# EasyEDA Pro project ProProject_SmartNixieClock_2023-12-15.epro, schematic Main_1
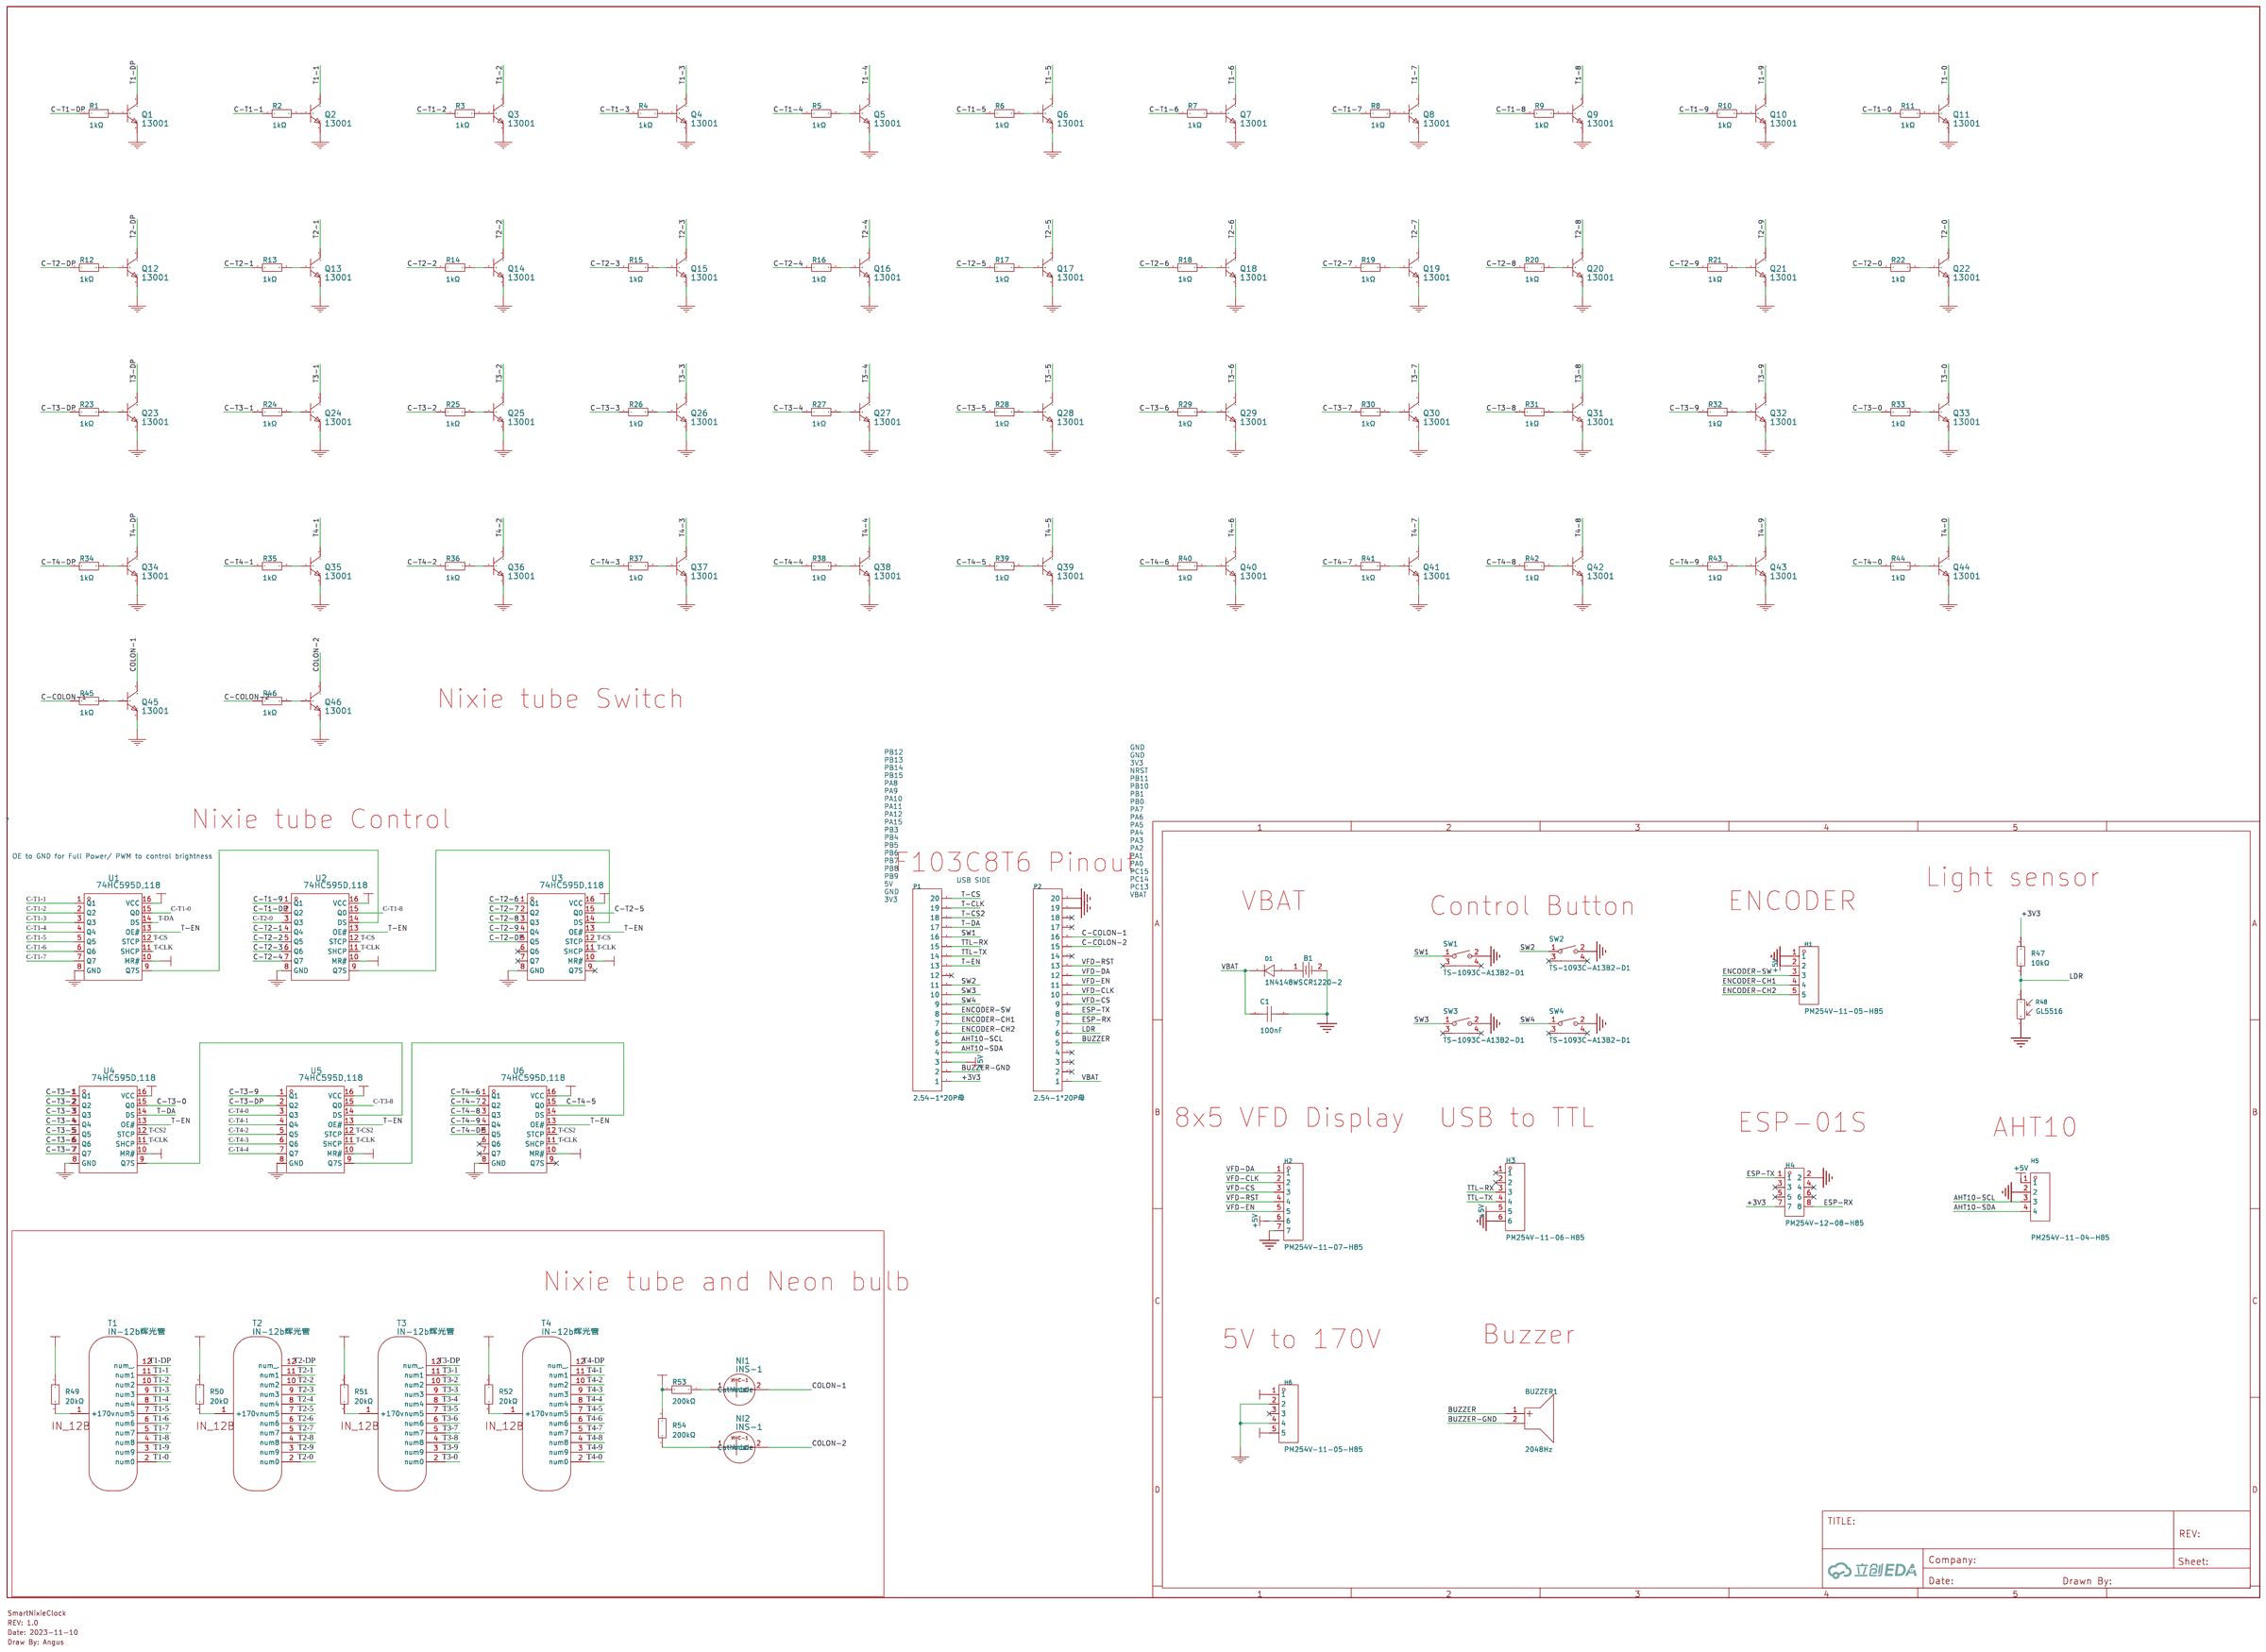
[diagram p1: schematic sheet]

## Parts
B1  CR1220-2  [BAT-SMD_CR1220-2]
BUZZER1  2048Hz  [BUZ-TH_BD12.0-P6.50-D0.6-FD]  (no BOM)
C1  100nF  [C0603]
D1  1N4148WS  [SOD-323_L1.8-W1.3-LS2.5-RD]
H1  PM254V-11-05-H85  [HDR-TH_5P-P2.54-V-F]
H2  PM254V-11-07-H85  [HDR-TH_7P-P2.54-V-F]
H3  PM254V-11-06-H85  [HDR-TH_6P-P2.54-V-F]
H4  PM254V-12-08-H85  [HDR-TH_8P-P2.54-V-F-R2-C4-S2.54]
H5  PM254V-11-04-H85  [HDR-TH_4P-P2.54-V-F]
H6  PM254V-11-05-H85  [HDR-TH_5P-P2.54-V-F]
NI1  INS-1  [INS-1]  (no BOM)
NI2  INS-1  [INS-1]  (no BOM)
P1  2.54-1*20P母  [HDR-TH_20P-P2.54-V-F]
P2  2.54-1*20P母  [HDR-TH_20P-P2.54-V-F]
Q1  13001  [SOT-23-3_L2.9-W1.3-P1.90-LS2.4-BR]
Q2  13001  [SOT-23-3_L2.9-W1.3-P1.90-LS2.4-BR]
Q3  13001  [SOT-23-3_L2.9-W1.3-P1.90-LS2.4-BR]
Q4  13001  [SOT-23-3_L2.9-W1.3-P1.90-LS2.4-BR]
Q5  13001  [SOT-23-3_L2.9-W1.3-P1.90-LS2.4-BR]
Q6  13001  [SOT-23-3_L2.9-W1.3-P1.90-LS2.4-BR]
Q7  13001  [SOT-23-3_L2.9-W1.3-P1.90-LS2.4-BR]
Q8  13001  [SOT-23-3_L2.9-W1.3-P1.90-LS2.4-BR]
Q9  13001  [SOT-23-3_L2.9-W1.3-P1.90-LS2.4-BR]
Q10  13001  [SOT-23-3_L2.9-W1.3-P1.90-LS2.4-BR]
Q11  13001  [SOT-23-3_L2.9-W1.3-P1.90-LS2.4-BR]
Q12  13001  [SOT-23-3_L2.9-W1.3-P1.90-LS2.4-BR]
Q13  13001  [SOT-23-3_L2.9-W1.3-P1.90-LS2.4-BR]
Q14  13001  [SOT-23-3_L2.9-W1.3-P1.90-LS2.4-BR]
Q15  13001  [SOT-23-3_L2.9-W1.3-P1.90-LS2.4-BR]
Q16  13001  [SOT-23-3_L2.9-W1.3-P1.90-LS2.4-BR]
Q17  13001  [SOT-23-3_L2.9-W1.3-P1.90-LS2.4-BR]
Q18  13001  [SOT-23-3_L2.9-W1.3-P1.90-LS2.4-BR]
Q19  13001  [SOT-23-3_L2.9-W1.3-P1.90-LS2.4-BR]
Q20  13001  [SOT-23-3_L2.9-W1.3-P1.90-LS2.4-BR]
Q21  13001  [SOT-23-3_L2.9-W1.3-P1.90-LS2.4-BR]
Q22  13001  [SOT-23-3_L2.9-W1.3-P1.90-LS2.4-BR]
Q23  13001  [SOT-23-3_L2.9-W1.3-P1.90-LS2.4-BR]
Q24  13001  [SOT-23-3_L2.9-W1.3-P1.90-LS2.4-BR]
Q25  13001  [SOT-23-3_L2.9-W1.3-P1.90-LS2.4-BR]
Q26  13001  [SOT-23-3_L2.9-W1.3-P1.90-LS2.4-BR]
Q27  13001  [SOT-23-3_L2.9-W1.3-P1.90-LS2.4-BR]
Q28  13001  [SOT-23-3_L2.9-W1.3-P1.90-LS2.4-BR]
Q29  13001  [SOT-23-3_L2.9-W1.3-P1.90-LS2.4-BR]
Q30  13001  [SOT-23-3_L2.9-W1.3-P1.90-LS2.4-BR]
Q31  13001  [SOT-23-3_L2.9-W1.3-P1.90-LS2.4-BR]
Q32  13001  [SOT-23-3_L2.9-W1.3-P1.90-LS2.4-BR]
Q33  13001  [SOT-23-3_L2.9-W1.3-P1.90-LS2.4-BR]
Q34  13001  [SOT-23-3_L2.9-W1.3-P1.90-LS2.4-BR]
Q35  13001  [SOT-23-3_L2.9-W1.3-P1.90-LS2.4-BR]
Q36  13001  [SOT-23-3_L2.9-W1.3-P1.90-LS2.4-BR]
Q37  13001  [SOT-23-3_L2.9-W1.3-P1.90-LS2.4-BR]
Q38  13001  [SOT-23-3_L2.9-W1.3-P1.90-LS2.4-BR]
Q39  13001  [SOT-23-3_L2.9-W1.3-P1.90-LS2.4-BR]
Q40  13001  [SOT-23-3_L2.9-W1.3-P1.90-LS2.4-BR]
Q41  13001  [SOT-23-3_L2.9-W1.3-P1.90-LS2.4-BR]
Q42  13001  [SOT-23-3_L2.9-W1.3-P1.90-LS2.4-BR]
Q43  13001  [SOT-23-3_L2.9-W1.3-P1.90-LS2.4-BR]
Q44  13001  [SOT-23-3_L2.9-W1.3-P1.90-LS2.4-BR]
Q45  13001  [SOT-23-3_L2.9-W1.3-P1.90-LS2.4-BR]
Q46  13001  [SOT-23-3_L2.9-W1.3-P1.90-LS2.4-BR]
R1  1kΩ  [R0805]
R2  1kΩ  [R0805]
R3  1kΩ  [R0805]
R4  1kΩ  [R0805]
R5  1kΩ  [R0805]
R6  1kΩ  [R0805]
R7  1kΩ  [R0805]
R8  1kΩ  [R0805]
R9  1kΩ  [R0805]
R10  1kΩ  [R0805]
R11  1kΩ  [R0805]
R12  1kΩ  [R0805]
R13  1kΩ  [R0805]
R14  1kΩ  [R0805]
R15  1kΩ  [R0805]
R16  1kΩ  [R0805]
R17  1kΩ  [R0805]
R18  1kΩ  [R0805]
R19  1kΩ  [R0805]
R20  1kΩ  [R0805]
R21  1kΩ  [R0805]
R22  1kΩ  [R0805]
R23  1kΩ  [R0805]
R24  1kΩ  [R0805]
R25  1kΩ  [R0805]
R26  1kΩ  [R0805]
R27  1kΩ  [R0805]
R28  1kΩ  [R0805]
R29  1kΩ  [R0805]
R30  1kΩ  [R0805]
R31  1kΩ  [R0805]
R32  1kΩ  [R0805]
R33  1kΩ  [R0805]
R34  1kΩ  [R0805]
R35  1kΩ  [R0805]
R36  1kΩ  [R0805]
R37  1kΩ  [R0805]
R38  1kΩ  [R0805]
R39  1kΩ  [R0805]
R40  1kΩ  [R0805]
R41  1kΩ  [R0805]
R42  1kΩ  [R0805]
R43  1kΩ  [R0805]
R44  1kΩ  [R0805]
R45  1kΩ  [R0805]
R46  1kΩ  [R0805]
R47  10kΩ  [R0805]
R48  GL5516  [RES-TH_L5.1-W4.3-P3.40-D0.5]  (no BOM)
R49  20kΩ  [R0805]
R50  20kΩ  [R0805]
R51  20kΩ  [R0805]
R52  20kΩ  [R0805]
R53  200kΩ  [R0805]
R54  200kΩ  [R0805]
SW1  TS-1093C-A13B2-D1  [SW-TH_TS-1093C-A13B3-D1]  (no BOM)
SW2  TS-1093C-A13B2-D1  [SW-TH_TS-1093C-A13B3-D1]  (no BOM)
SW3  TS-1093C-A13B2-D1  [SW-TH_TS-1093C-A13B3-D1]  (no BOM)
SW4  TS-1093C-A13B2-D1  [SW-TH_TS-1093C-A13B3-D1]  (no BOM)
T1  IN-12b辉光管  [IN-12b(正常,插針在上面)]  (no BOM)
T2  IN-12b辉光管  [IN-12b(正常,插針在上面)]  (no BOM)
T3  IN-12b辉光管  [IN-12b(正常,插針在上面)]  (no BOM)
T4  IN-12b辉光管  [IN-12b(正常,插針在上面)]  (no BOM)
U1  74HC595D,118  [SOIC-16_L9.9-W3.9-P1.27-LS6.0-BL]
U2  74HC595D,118  [SOIC-16_L9.9-W3.9-P1.27-LS6.0-BL]
U3  74HC595D,118  [SOIC-16_L9.9-W3.9-P1.27-LS6.0-BL]
U4  74HC595D,118  [SOIC-16_L9.9-W3.9-P1.27-LS6.0-BL]
U5  74HC595D,118  [SOIC-16_L9.9-W3.9-P1.27-LS6.0-BL]
U6  74HC595D,118  [SOIC-16_L9.9-W3.9-P1.27-LS6.0-BL]

## Library data of the parts
B1 = CR1220-2: 连接器类型:电池底座;适用电池规格:CR1220;工作温度范围:-;; LCSC Part Name: 电池底座 适用电池:CR1220; Supplier Part: C70381; Manufacturer: Q&amp;J; Supplier Footprint: SMD; JLCPCB Part Class: Extended Part; Datasheet: https://atta.szlcsc.com/upload/public/pdf/source/20160427/1461725216696.pdf; Supplier: LCSC; Connector Type: 电池底座; Battery Type: CR1220
BUZZER1 = YS-MBZ12085C05R42: 驱动方式:无源(外部驱动);构造类型:电磁式;额定电压:5V;工作电压:3V~7V;频率:2048Hz;声压(SPL):85dB@5V,10cm;直径(φD):12mm;高度:8.7mm;; LCSC Part Name: 电磁式无源分体蜂鸣器5V; Supplier Part: C409842; Manufacturer: Fengming(锋鸣电子); Supplier Footprint: 插件,D=12mm; JLCPCB Part Class: 扩展库; Datasheet: https://atta.szlcsc.com/upload/public/pdf/source/20191217/C409842_D981B29AAA35E8D23D61A24851812BB0.pdf; Supplier: LCSC; Oscillator Circuit: 无源(外部驱动); Technology Type: 电磁式; Rated Voltage: 5V; Operating Voltage: 3V~7V; Sound Pressure Level (SPL): 85dB@5V,10cm; Diameter (φD): 12mm; Height: 8.7mm
C1 = CC0603KRX7R9BB104: 容值:100nF;精度:±10%;额定电压:50V;材质(温度系数):X7R;; LCSC Part Name: 100nF ±10% 50V; Supplier Part: C14663; Manufacturer: YAGEO(国巨); Supplier Footprint: 0603; JLCPCB Part Class: 基础库; Datasheet: https://atta.szlcsc.com/upload/public/pdf/source/20180910/C282072_33301C7F631E79921B82A8DAC6BCC5B3.pdf; Supplier: LCSC; Tolerance: ±10%; Voltage Rated: 50V; Temperature Coefficient: X7R
D1 = 1N4148WS_C2128: 二极管配置:独立式;功率:200mW;直流反向耐压(Vr):100V;平均整流电流(Io):150mA;正向压降(Vf):1.25V@150mA;反向电流(Ir):1uA@75V;反向恢复时间(trr):4ns;工作温度:+150℃@(Tj);; LCSC Part Name: 100V 150mA 4ns T4; Supplier Part: C2128; Manufacturer: CJ(江苏长电/长晶); Supplier Footprint: SOD-323; JLCPCB Part Class: 基础库; Supplier: LCSC; Diode Configuration: 独立式; Power Dissipation: 200mW; Reverse Voltage (Vr): 100V; Average Rectified Current (Io): 150mA; Forward Voltage (Vf@If): 1.25V@150mA; Reverse Leakage Current: 1uA@75V; Reverse Recovery Time (trr): 4ns; Operating Temperature: +150℃@(Tj)
H1 H6 = PM254V-11-05-H85: 排数:单排;总孔位数:5P;间距:2.54mm;插孔结构:1x5P;行距:-;安装类型:直插;塑高:-;触头材质:黄铜;触头镀层:-;; LCSC Part Name: 间距:2.54mm 1x5P 直插; Supplier Part: C541852; Manufacturer: XFCN(兴飞); Supplier Footprint: 插件,P=2.54mm; JLCPCB Part Class: Extended Part; Datasheet: https://atta.szlcsc.com/upload/public/pdf/source/20200518/C541849_85853D71FC67C51915A806977A588FDA.pdf; Supplier: LCSC; Number of Rows: 单排; Number of Holes: 5P; Pitch: 2.54mm; Holes Structure: 1x5P; Mounting Type: 直插; Contact Material: 黄铜
H2 = PM254V-11-07-H85: 排数:单排;总孔位数:7P;间距:2.54mm;插孔结构:1x7P;行距:-;安装类型:直插;圆孔/方孔:方孔;额定电流:3A;额定电压:250V;插孔方向:顶部;塑高:-;工作温度范围:-40℃~+105℃;; LCSC Part Name: 间距:2.54mm 1x7P 直插; Supplier Part: C2832270; Manufacturer: XFCN(兴飞); Supplier Footprint: 插件,P=2.54mm; JLCPCB Part Class: Extended Part; Datasheet: https://atta.szlcsc.com/upload/public/pdf/source/20210514/C2832270_F424CC0071A81298BFB56B53406F9842.pdf; Supplier: LCSC; Number of Rows: 单排; Number of Holes: 7P; Pitch: 2.54mm; Holes Structure: 1x7P; Mounting Type: 直插; Circular Hole / Square Hole: 方孔; Current Rating (Max): 3A; Voltage Rating (Max): 250V; Holes Direction: 顶部; Operating Temperature Range: -40℃~+105℃
H3 = PM254V-11-06-H85: 排数:单排;总孔位数:6P;间距:2.54mm;插孔结构:1x6P;行距:-;安装类型:直插;圆孔/方孔:方孔;额定电流:3A;额定电压:250V;插孔方向:顶部;塑高:-;工作温度范围:-40℃~+105℃;; LCSC Part Name: 间距:2.54mm 1x6P 直插; Supplier Part: C2832269; Manufacturer: XFCN(兴飞); Supplier Footprint: 插件,P=2.54mm; JLCPCB Part Class: 扩展库; Datasheet: https://atta.szlcsc.com/upload/public/pdf/source/20210514/C2832269_B3EC97736B37C2783BDCE3050AA57447.pdf; Supplier: LCSC; Number of Rows: 单排; Number of Holes: 6P; Pitch: 2.54mm; Holes Structure: 1x6P; Mounting Type: 直插; Circular Hole / Square Hole: 方孔; Current Rating (Max): 3A; Voltage Rating (Max): 250V; Holes Direction: 顶部; Operating Temperature Range: -40℃~+105℃
H4 = PM254V-12-08-H85: 排数:双排;总孔位数:8P;间距:2.54mm;插孔结构:2x4P;行距:2.54mm;安装类型:直插;圆孔/方孔:方孔;额定电流:3A;额定电压:250V;插孔方向:顶部;塑高:8.5mm;工作温度范围:-40℃~+105℃;; LCSC Part Name: 间距:2.54mm 2x4P 直插; Supplier Part: C2834799; Manufacturer: XFCN(兴飞); Supplier Footprint: 插件,P=2.54mm; JLCPCB Part Class: 扩展库; Datasheet: https://atta.szlcsc.com/upload/public/pdf/source/20200309/C492399_8C441E2934FBB604A89B37A68AA45ECF.pdf; Supplier: LCSC; Number of Rows: 双排; Number of Holes: 8P; Pitch: 2.54mm; Holes Structure: 2x4P; Row Spacing: 2.54mm; Mounting Type: 直插; Circular Hole / Square Hole: 方孔; Current Rating (Max): 3A; Voltage Rating (Max): 250V; Holes Direction: 顶部; Insulation Height: 8.5mm; Operating Temperature Range: -40℃~+105℃
H5 = PM254V-11-04-H85: 排数:单排;总孔位数:4P;间距:2.54mm;插孔结构:1x4P;行距:-;安装类型:直插;塑高:-;触头材质:黄铜;触头镀层:-;; LCSC Part Name: 间距:2.54mm 1x4P 直插; Supplier Part: C541851; Manufacturer: XFCN(兴飞); Supplier Footprint: 插件,P=2.54mm; JLCPCB Part Class: Extended Part; Datasheet: https://atta.szlcsc.com/upload/public/pdf/source/20200518/C541849_85853D71FC67C51915A806977A588FDA.pdf; Supplier: LCSC; Number of Rows: 单排; Number of Holes: 4P; Pitch: 2.54mm; Holes Structure: 1x4P; Mounting Type: 直插; Contact Material: 黄铜
NI1 NI2 = INS-1
P1 P2 = 2.54-1*20P母: 排数:单排;总孔位数:20;间距:2.54mm;插孔结构:1x20P;行距:-;安装类型:直插;塑高:-;触头材质:-;触头镀层:-;; LCSC Part Name: 2.54mm 1x20P; Supplier Part: C50984; Manufacturer: BOOMELE(博穆精密); Supplier Footprint: 直插,P=2.54mm; JLCPCB Part Class: Extended Part; Supplier: LCSC; Number of Rows: 单排; Number of Holes: 20; Pitch: 2.54mm; Holes Structure: 1x20P; Mounting Type: 直插
Q1-Q46 = 13001_C2904842: 晶体管类型:NPN;集射极击穿电压(Vceo):400V;集电极电流(Ic):250mA;功率(Pd):1W;集电极截止电流(Icbo):100uA;集电极-发射极饱和电压(VCE(sat)@Ic,Ib):600mV@100mA,20mA;直流电流增益(hFE@Ic,Vce):10@20mA,20V;特征频率(fT):5MHz;工作温度:+150℃@(Tj);; Supplier Part: C2904842; Manufacturer: YONGYUTAI(永裕泰); Supplier Footprint: SOT-23; JLCPCB Part Class: Extended Part; Datasheet: https://atta.szlcsc.com/upload/public/pdf/source/20211011/662D795392E5FB6F4752F30EDCC66E3B.pdf; Supplier: LCSC; Transistor Type: NPN; Collector-Emitter Breakdown Voltage (Vceo): 400V; Collector Current (Ic): 250mA; Power Dissipation (Pd): 1W; Collector Cut-Off Current (Icbo): 100uA; Collector-Emitter Saturation Voltage (VCE(sat)@Ic,Ib): 600mV@100mA,20mA; DC Current Gain (hFE@Ic,Vce): 10@20mA,20V; Transition Frequency (fT): 5MHz; Operating Temperature: +150℃@(Tj)
R1-R46 = 0805W8F1001T5E: 电阻类型:厚膜电阻;阻值:1kΩ;精度:±1%;功率:125mW;; LCSC Part Name: 1kΩ ±1% 125mW; Supplier Part: C17513; Manufacturer: UNI-ROYAL(厚声); Supplier Footprint: 0805; JLCPCB Part Class: Basic Part; Datasheet: https://atta.szlcsc.com/upload/public/pdf/source/20200306/C422600_1E6D84923E4A46A82E41ADD87F860B5C.pdf; Supplier: LCSC; Type: 厚膜电阻; Tolerance: ±1%; Power(Watts): 125mW; Temperature Coefficient: ±100ppm/℃; Overload Voltage (Max): 150V; Operating Temperature Range: -55℃~+155℃
R47 = 0805W8F1002T5E_C17414: 电阻类型:厚膜电阻;阻值:10kΩ;精度:±1%;功率:125mW;; LCSC Part Name: 10kΩ ±1% 125mW; Supplier Part: C17414; Manufacturer: UNI-ROYAL(厚声); Manufacturer Part: 0805W8F1002T5E; Supplier Footprint: 0805; JLCPCB Part Class: 基础库; Datasheet: https://atta.szlcsc.com/upload/public/pdf/source/20200306/C422600_1E6D84923E4A46A82E41ADD87F860B5C.pdf; Supplier: LCSC; Type: 厚膜电阻; Tolerance: ±1%; Power(Watts): 125mW; Temperature Coefficient: ±100ppm/℃; Overload Voltage (Max): 150V; Operating Temperature Range: -55℃~+155℃
R48 = GL5516: 光谱峰值(波长):540nm;亮电阻 @ 10Lux:5kΩ~10kΩ;暗电阻:500kΩ;; LCSC Part Name: 亮电阻:5kΩ~10kΩ 暗电阻:500kΩ; Supplier Part: C125626; Manufacturer: 森霸; Supplier Footprint: 插件,P=3mm; JLCPCB Part Class: 扩展库; Datasheet: https://atta.szlcsc.com/upload/public/pdf/source/20170810/C125631_1502335367544879947.pdf; Supplier: LCSC; Spectral Peak: 540nm; Applied Voltage: 150V; Illuminated Resistance @ 10Lux: 5kΩ~10kΩ; Dark Resistance: 500kΩ
R49-R52 = 0805W8F2002T5E: 电阻类型:厚膜电阻;阻值:20kΩ;精度:±1%;功率:125mW;; LCSC Part Name: 20kΩ ±1% 125mW; Supplier Part: C4328; Manufacturer: UNI-ROYAL(厚声); Supplier Footprint: 0805; JLCPCB Part Class: Basic Part; Datasheet: https://atta.szlcsc.com/upload/public/pdf/source/20200306/C422600_1E6D84923E4A46A82E41ADD87F860B5C.pdf; Supplier: LCSC; Type: 厚膜电阻; Tolerance: ±1%; Power(Watts): 125mW; Temperature Coefficient: ±100ppm/℃; Overload Voltage (Max): 150V; Operating Temperature Range: -55℃~+155℃
R53 R54 = 0805W8F2003T5E: 电阻类型:厚膜电阻;阻值:200kΩ;精度:±1%;功率:125mW;; LCSC Part Name: 200kΩ ±1% 125mW; Supplier Part: C17539; Manufacturer: UNI-ROYAL(厚声); Supplier Footprint: 0805; JLCPCB Part Class: Basic Part; Datasheet: https://atta.szlcsc.com/upload/public/pdf/source/20200306/C422600_1E6D84923E4A46A82E41ADD87F860B5C.pdf; Supplier: LCSC; Type: 厚膜电阻; Tolerance: ±1%; Power(Watts): 125mW; Temperature Coefficient: ±100ppm/℃; Overload Voltage (Max): 150V; Operating Temperature Range: -55℃~+155℃
SW1-SW4 = TS-1093C-A13B2-D1: 电路结构:单刀单掷;安装方式:卧插;作用力:180gf@±30gf;机械寿命:-;带支架:是;; LCSC Part Name: 6*6*10mm 卧插 轻触开关; Supplier Part: C2682924; Manufacturer: Yuandi(元迪); Supplier Footprint: 插件; JLCPCB Part Class: Extended Part; Datasheet: https://atta.szlcsc.com/upload/public/pdf/source/20210107/C2682912_A8F430B4F140DAC81FB7E2D14E5A08CF.pdf; Supplier: LCSC; Circuit: 单刀单掷; Mounting Style: 卧插; Actuator Style: 圆形按钮; Actuator/Cap Color: 黑色; Operating Force: 180gf@±30gf; Pin Style: PC引脚; Switch Length: 6mm; Switch Width: 6mm; Switch Height: 10mm; Strike Gundam: 是
T1-T4 = IN-12b辉光管
U1-U6 = 74HC595D,118: 每个元件位数:8;功能:串行至并行或串行;电源电压:2V~6V;; LCSC Part Name: 三态输出 串行至串行或并行移位寄存器; Supplier Part: C5947; Manufacturer: Nexperia(安世); Supplier Footprint: SOP-16; JLCPCB Part Class: Basic Part; Datasheet: https://atta.szlcsc.com/upload/public/pdf/source/20140108/1457706668762.pdf; Supplier: LCSC; Series: 74HC; Number of Bits per Element: 8; Output Type: 三态; Function: 串行至并行或串行; Supply Voltage: 2V~6V; Operating Temperature: 40℃~+125℃

## Nets
+3V3: H4.7 P1.1 R47.2
+5V: H1.2 H2.6 H3.5 H5.1 H6.5 P1.3 U1.10(MR#) U1.16(VCC) U2.10(MR#) U2.16(VCC) U3.10(MR#) U3.16(VCC) U4.10(MR#) U4.16(VCC) U5.10(MR#) U5.16(VCC) U6.10(MR#) U6.16(VCC)
+170V: H6.1 R49.1 R50.1 R51.1 R52.1 R53.1 R54.2
GND: B1.2 C1.2 H1.1 H2.7 H3.6 H4.2 H5.2 H6.2 H6.4 P2.19 P2.20 Q1.2(E) Q2.2(E) Q3.2(E) Q4.2(E) Q5.2(E) Q6.2(E) Q7.2(E) Q8.2(E) Q9.2(E) Q10.2(E) Q11.2(E) Q12.2(E) Q13.2(E) Q14.2(E) Q15.2(E) Q16.2(E) Q17.2(E) Q18.2(E) Q19.2(E) Q20.2(E) Q21.2(E) Q22.2(E) Q23.2(E) Q24.2(E) Q25.2(E) Q26.2(E) Q27.2(E) Q28.2(E) Q29.2(E) Q30.2(E) Q31.2(E) Q32.2(E) Q33.2(E) Q34.2(E) Q35.2(E) Q36.2(E) Q37.2(E) Q38.2(E) Q39.2(E) Q40.2(E) Q41.2(E) Q42.2(E) Q43.2(E) Q44.2(E) Q45.2(E) Q46.2(E) R48.2 SW1.2 SW2.2 SW3.2 SW4.2 U1.8(GND) U2.8(GND) U3.8(GND) U4.8(GND) U5.8(GND) U6.8(GND)
VBAT: C1.1 D1.1(K) P2.1
AHT10-SCL: H5.3 P1.5
AHT10-SDA: H5.4 P1.4
BUZZER: BUZZER1.1(+) P2.5
BUZZER-GND: BUZZER1.2(-) P1.2
C-COLON-1: P2.16 R45.1
C-COLON-2: P2.15 R46.1
C-T1-0: R11.1 U1.15(Q0)
C-T1-1: R2.1 U1.1(Q1)
C-T1-2: R3.1 U1.2(Q2)
C-T1-3: R4.1 U1.3(Q3)
C-T1-4: R5.1 U1.4(Q4)
C-T1-5: R6.1 U1.5(Q5)
C-T1-6: R7.1 U1.6(Q6)
C-T1-7: R8.1 U1.7(Q7)
C-T1-8: R9.1 U2.15(Q0)
C-T1-9: R10.1 U2.1(Q1)
C-T1-DP: R1.1 U2.2(Q2)
C-T2-0: R22.1 U2.3(Q3)
C-T2-1: R13.1 U2.4(Q4)
C-T2-2: R14.1 U2.5(Q5)
C-T2-3: R15.1 U2.6(Q6)
C-T2-4: R16.1 U2.7(Q7)
C-T2-5: R17.1 U3.15(Q0)
C-T2-6: R18.1 U3.1(Q1)
C-T2-7: R19.1 U3.2(Q2)
C-T2-8: R20.1 U3.3(Q3)
C-T2-9: R21.1 U3.4(Q4)
C-T2-DP: R12.1 U3.5(Q5)
C-T3-0: R33.1 U4.15(Q0)
C-T3-1: R24.1 U4.1(Q1)
C-T3-2: R25.1 U4.2(Q2)
C-T3-3: R26.1 U4.3(Q3)
C-T3-4: R27.1 U4.4(Q4)
C-T3-5: R28.1 U4.5(Q5)
C-T3-6: R29.1 U4.6(Q6)
C-T3-7: R30.1 U4.7(Q7)
C-T3-8: R31.1 U5.15(Q0)
C-T3-9: R32.1 U5.1(Q1)
C-T3-DP: R23.1 U5.2(Q2)
C-T4-0: R44.1 U5.3(Q3)
C-T4-1: R35.1 U5.4(Q4)
C-T4-2: R36.1 U5.5(Q5)
C-T4-3: R37.1 U5.6(Q6)
C-T4-4: R38.1 U5.7(Q7)
C-T4-5: R39.1 U6.15(Q0)
C-T4-6: R40.1 U6.1(Q1)
C-T4-7: R41.1 U6.2(Q2)
C-T4-8: R42.1 U6.3(Q3)
C-T4-9: R43.1 U6.4(Q4)
C-T4-DP: R34.1 U6.5(Q5)
COLON-1: NI1.2(Cathode) Q45.3(C)
COLON-2: NI2.2(Cathode) Q46.3(C)
ENCODER-CH1: H1.4 P1.7
ENCODER-CH2: H1.5 P1.6
ENCODER-SW: H1.3 P1.8
ESP-RX: H4.8 P2.7
ESP-TX: H4.1 P2.8
LDR: P2.6 R47.1 R48.1
SW1: P1.16 SW1.1
SW2: P1.11 SW2.1
SW3: P1.10 SW3.1
SW4: P1.9 SW4.1
T1-0: Q11.3(C) T1.2(num0)
T1-1: Q2.3(C) T1.11(num1)
T1-2: Q3.3(C) T1.10(num2)
T1-3: Q4.3(C) T1.9(num3)
T1-4: Q5.3(C) T1.8(num4)
T1-5: Q6.3(C) T1.7(num5)
T1-6: Q7.3(C) T1.6(num6)
T1-7: Q8.3(C) T1.5(num7)
T1-8: Q9.3(C) T1.4(num8)
T1-9: Q10.3(C) T1.3(num9)
T1-DP: Q1.3(C) T1.12(num .)
T2-0: Q22.3(C) T2.2(num0)
T2-1: Q13.3(C) T2.11(num1)
T2-2: Q14.3(C) T2.10(num2)
T2-3: Q15.3(C) T2.9(num3)
T2-4: Q16.3(C) T2.8(num4)
T2-5: Q17.3(C) T2.7(num5)
T2-6: Q18.3(C) T2.6(num6)
T2-7: Q19.3(C) T2.5(num7)
T2-8: Q20.3(C) T2.4(num8)
T2-9: Q21.3(C) T2.3(num9)
T2-DP: Q12.3(C) T2.12(num .)
T3-0: Q33.3(C) T3.2(num0)
T3-1: Q24.3(C) T3.11(num1)
T3-2: Q25.3(C) T3.10(num2)
T3-3: Q26.3(C) T3.9(num3)
T3-4: Q27.3(C) T3.8(num4)
T3-5: Q28.3(C) T3.7(num5)
T3-6: Q29.3(C) T3.6(num6)
T3-7: Q30.3(C) T3.5(num7)
T3-8: Q31.3(C) T3.4(num8)
T3-9: Q32.3(C) T3.3(num9)
T3-DP: Q23.3(C) T3.12(num .)
T4-0: Q44.3(C) T4.2(num0)
T4-1: Q35.3(C) T4.11(num1)
T4-2: Q36.3(C) T4.10(num2)
T4-3: Q37.3(C) T4.9(num3)
T4-4: Q38.3(C) T4.8(num4)
T4-5: Q39.3(C) T4.7(num5)
T4-6: Q40.3(C) T4.6(num6)
T4-7: Q41.3(C) T4.5(num7)
T4-8: Q42.3(C) T4.4(num8)
T4-9: Q43.3(C) T4.3(num9)
T4-DP: Q34.3(C) T4.12(num .)
T-CLK: P1.19 U1.11(SHCP) U2.11(SHCP) U3.11(SHCP) U4.11(SHCP) U5.11(SHCP) U6.11(SHCP)
T-CS: P1.20 U1.12(STCP) U2.12(STCP) U3.12(STCP)
T-CS2: P1.18 U4.12(STCP) U5.12(STCP) U6.12(STCP)
T-DA: P1.17 U1.14(DS) U4.14(DS)
T-EN: P1.13 U1.13(OE#) U2.13(OE#) U3.13(OE#) U4.13(OE#) U5.13(OE#) U6.13(OE#)
TTL-RX: H3.3 P1.15
TTL-TX: H3.4 P1.14
VFD-CLK: H2.2 P2.10
VFD-CS: H2.3 P2.9
VFD-DA: H2.1 P2.12
VFD-EN: H2.5 P2.11
VFD-RST: H2.4 P2.13
$1N458: U1.9(Q7S) U2.14(DS)
$1N3740: Q1.1(B) R1.2
$1N7569: Q2.1(B) R2.2
$1N7748: Q3.1(B) R3.2
$1N7754: Q4.1(B) R4.2
$1N8478: Q5.1(B) R5.2
$1N8484: Q6.1(B) R6.2
$1N8490: Q7.1(B) R7.2
$1N8496: Q8.1(B) R8.2
$1N8764: Q9.1(B) R9.2
$1N8770: Q10.1(B) R10.2
$1N8776: Q11.1(B) R11.2
$1N9030: U2.9(Q7S) U3.14(DS)
$1N10580: Q12.1(B) R12.2
$1N10586: Q13.1(B) R13.2
$1N10592: Q14.1(B) R14.2
$1N10598: Q15.1(B) R15.2
$1N10604: Q16.1(B) R16.2
$1N10610: Q17.1(B) R17.2
$1N10616: Q18.1(B) R18.2
$1N10622: Q19.1(B) R19.2
$1N10628: Q20.1(B) R20.2
$1N10634: Q21.1(B) R21.2
$1N10640: Q22.1(B) R22.2
$1N12549: Q23.1(B) R23.2
$1N12555: Q24.1(B) R24.2
$1N12561: Q25.1(B) R25.2
$1N12567: Q26.1(B) R26.2
$1N12573: Q27.1(B) R27.2
$1N12579: Q28.1(B) R28.2
$1N12585: Q29.1(B) R29.2
$1N12591: Q30.1(B) R30.2
$1N12597: Q31.1(B) R31.2
$1N12603: Q32.1(B) R32.2
$1N12609: Q33.1(B) R33.2
$1N12615: Q34.1(B) R34.2
$1N12621: Q35.1(B) R35.2
$1N12627: Q36.1(B) R36.2
$1N12633: Q37.1(B) R37.2
$1N12639: Q38.1(B) R38.2
$1N12645: Q39.1(B) R39.2
$1N12651: Q40.1(B) R40.2
$1N12657: Q41.1(B) R41.2
$1N12663: Q42.1(B) R42.2
$1N12669: Q43.1(B) R43.2
$1N12675: Q44.1(B) R44.2
$1N19417: Q45.1(B) R45.2
$1N43535: Q46.1(B) R46.2
$1N54382: U5.9(Q7S) U6.14(DS)
$1N105872: R49.2 T1.1(+170v)
$1N105896: R50.2 T2.1(+170v)
$1N105920: R51.2 T3.1(+170v)
$1N105944: R52.2 T4.1(+170v)
$1N105947: NI2.1(Anode) R54.1
$1N105948: NI1.1(Anode) R53.2
$1N167698: B1.1 D1.2(A)
$1N177857: U4.9(Q7S) U5.14(DS)

Not connected (* = marked no-connect by the designer): H3 1* 2*; H4 3* 4* 5* 6*; H6 3*; P1 12*; P2 2* 3* 4* 14* 17* 18*; SW1 3(EP)* 4(EP)*; SW2 3(EP)* 4(EP)*; SW3 3(EP)* 4(EP)*; SW4 3(EP)* 4(EP)*; U3 6(Q6)* 7(Q7)* 9(Q7S)*; U6 6(Q6)* 7(Q7)* 9(Q7S)*

## Notes on the sheet
- Nixie tube Switch
- Nixie tube Control
- OE to GND for Full Power/ PWM to control brightness
- F103C8T6 Pinout
- USB SIDE
- Light sensor
- GND
  GND
  3V3
  NRST
  PB11
  PB10
  PB1
  PB0
  PA7
  PA6
  PA5
  PA4
  PA3
  PA2
  PA1
  PA0
  PC15
  PC14
  PC13
  VBAT
- PB12
  PB13
  PB14
  PB15
  PA8
  PA9
  PA10
  PA11
  PA12
  PA15
  PB3
  PB4
  PB5
  PB6
  PB7
  PB8
  PB9
  5V
  GND
  3V3
- VBAT
- Control Button
- ENCODER
- 8x5 VFD Display
- USB to TTL
- ESP-01S
- AHT10
- Nixie tube and Neon bulb
- 5V to 170V
- Buzzer
